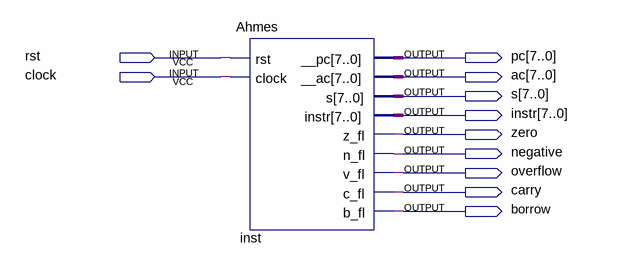
[diagram p0: schematic sheet]
// Quartus schematic testes.bdf as structural Verilog: 1 symbols, 11 pins
module testes (
  input  rst,
  input  clock,
  output [7:0] pc,
  output [7:0] ac,
  output [7:0] s,
  output [7:0] instr,
  output zero,
  output negative,
  output overflow,
  output carry,
  output borrow
);

  Ahmes inst (
    .rst(rst), .clock(clock), .__pc(pc), .__ac(ac), .s(s), .instr(instr), .z_fl(zero), .n_fl(negative),
    .v_fl(overflow), .c_fl(carry), .b_fl(borrow));
endmodule
